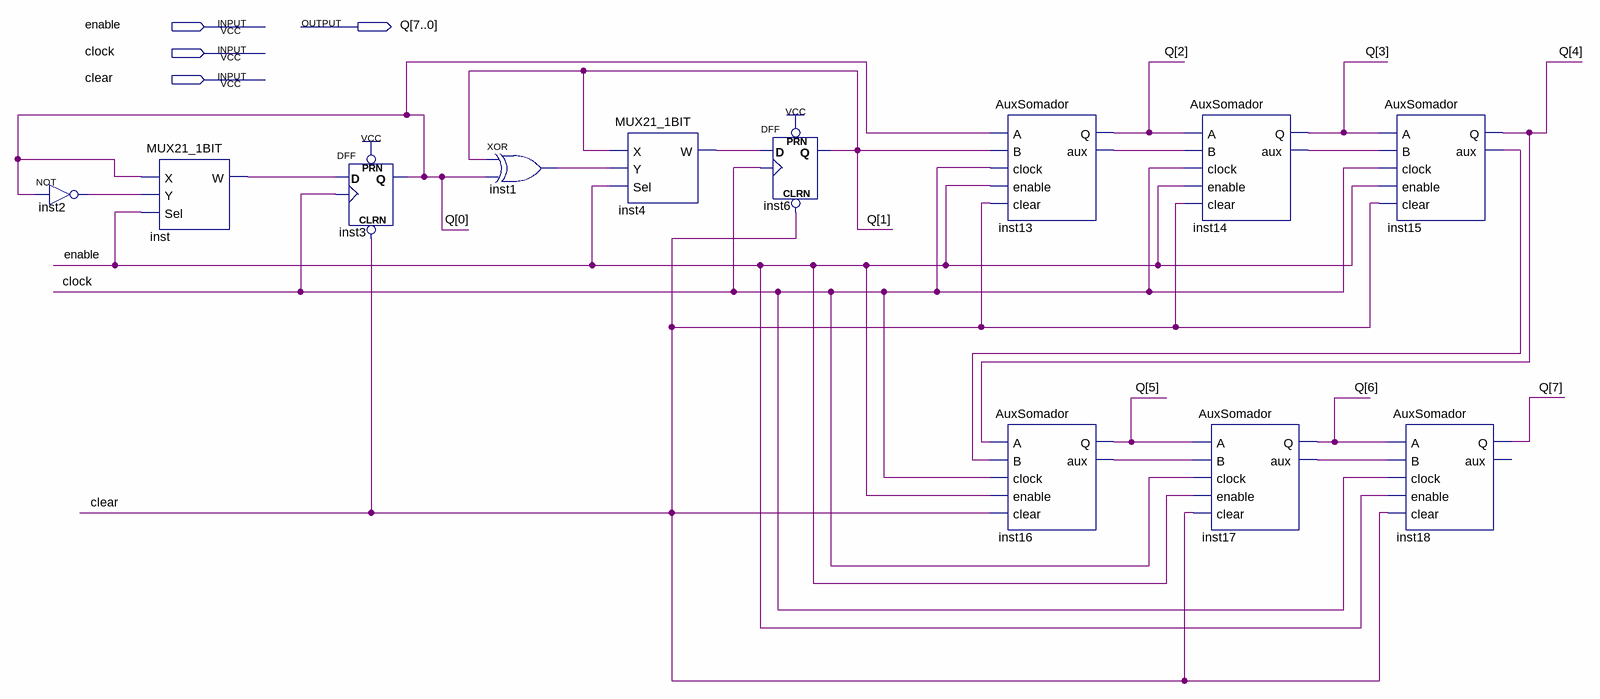
[diagram p0: schematic sheet]
// Quartus schematic Somador.bdf as structural Verilog: 12 symbols, 4 pins
module Somador (
  input  enable,
  input  clock,
  input  clear,
  output [7:0] Q
);

  wire inst1_out, inst2_out, inst4_w, inst13_aux, inst14_aux, inst15_aux, inst16_aux, inst17_aux, inst_w;

  not inst2 (inst2_out, Q[0]);
  MUX21_1BIT inst (.X(Q[0]), .Y(inst2_out), .Sel(enable), .W(inst_w));
  DFF inst3 (.CLRN(clear), .CLK(clock), .D(inst_w), .PRN(1'b1), .Q(Q[0]));
  xor inst1 (inst1_out, Q[1], Q[0]);
  MUX21_1BIT inst4 (.X(Q[1]), .Y(inst1_out), .Sel(enable), .W(inst4_w));
  DFF inst6 (.CLRN(clear), .CLK(clock), .D(inst4_w), .PRN(1'b1), .Q(Q[1]));
  AuxSomador inst13 (.A(Q[0]), .B(Q[1]), .clock(clock), .enable(enable), .clear(clear), .Q(Q[2]), .aux(inst13_aux));
  AuxSomador inst16 (
    .A(Q[4]), .B(inst15_aux), .clock(clock), .enable(enable), .clear(clear), .Q(Q[5]), .aux(inst16_aux));
  AuxSomador inst14 (
    .A(Q[2]), .B(inst13_aux), .clock(clock), .enable(enable), .clear(clear), .Q(Q[3]), .aux(inst14_aux));
  AuxSomador inst17 (
    .A(Q[5]), .B(inst16_aux), .clock(clock), .enable(enable), .clear(clear), .Q(Q[6]), .aux(inst17_aux));
  AuxSomador inst15 (
    .A(Q[3]), .B(inst14_aux), .clock(clock), .enable(enable), .clear(clear), .Q(Q[4]), .aux(inst15_aux));
  AuxSomador inst18 (.A(Q[6]), .B(inst17_aux), .clock(clock), .enable(enable), .clear(clear), .Q(Q[7]));  // open: aux
endmodule
